# EAGLE schematic al (EAGLE 6.5.0)
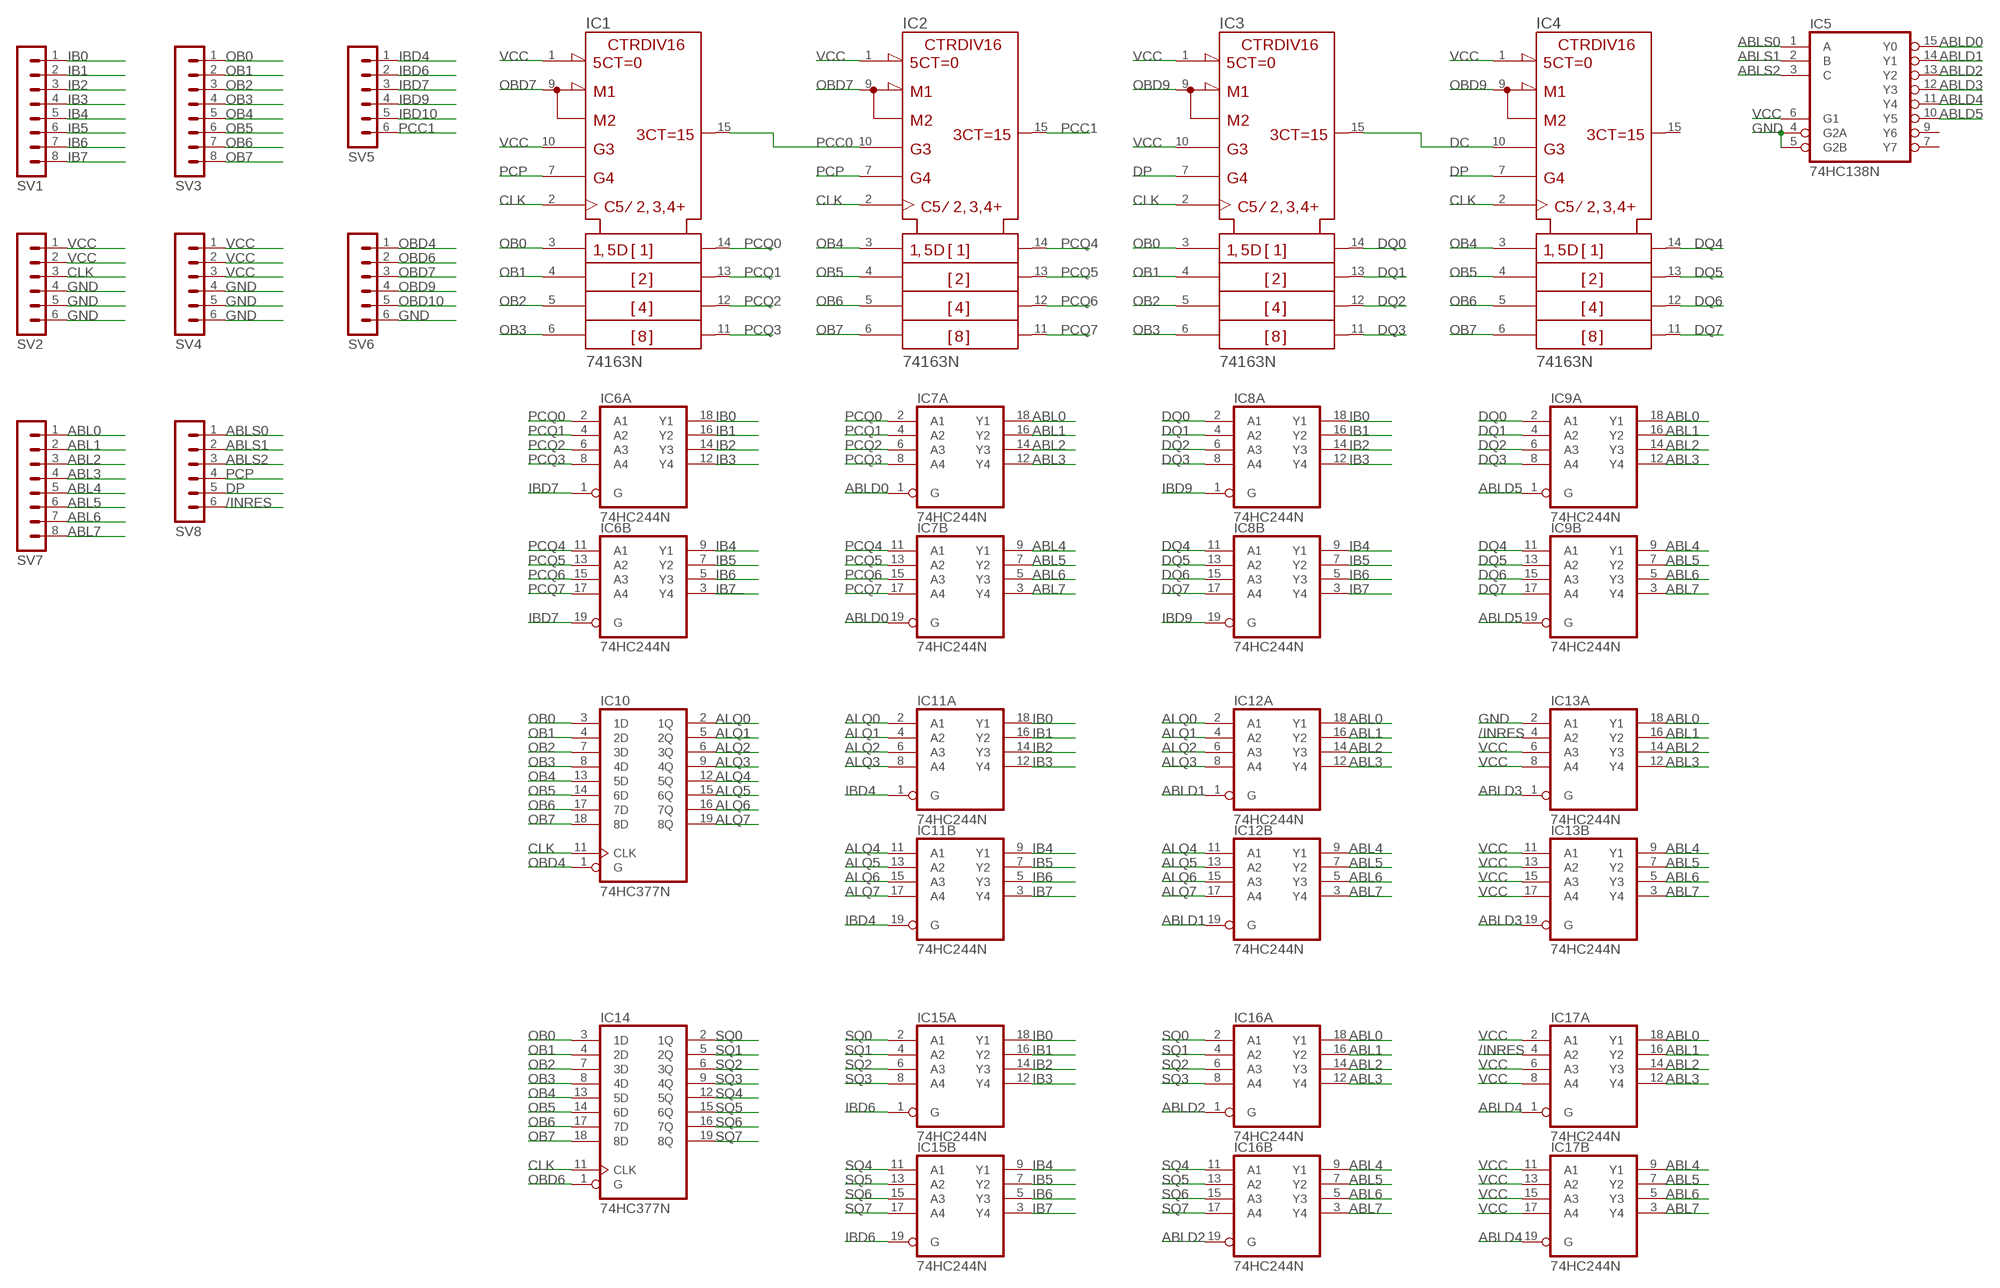
[diagram p0: schematic, sheet 1]

## Parts
IC1  74163N  [DIL16]
IC2  74163N  [DIL16]
IC3  74163N  [DIL16]
IC4  74163N  [DIL16]
IC5  74HC138N  [DIL16]
IC6  74HC244N  [DIL20]
IC7  74HC244N  [DIL20]
IC8  74HC244N  [DIL20]
IC9  74HC244N  [DIL20]
IC10  74HC377N  [DIL20]
IC11  74HC244N  [DIL20]
IC12  74HC244N  [DIL20]
IC13  74HC244N  [DIL20]
IC14  74HC377N  [DIL20]
IC15  74HC244N  [DIL20]
IC16  74HC244N  [DIL20]
IC17  74HC244N  [DIL20]
SV1  MA08-1  [MA08-1]
SV2  MA06-1  [MA06-1]
SV3  MA08-1  [MA08-1]
SV4  MA06-1  [MA06-1]
SV5  MA06-1  [MA06-1]
SV6  MA06-1  [MA06-1]
SV7  MA08-1  [MA08-1]
SV8  MA06-1  [MA06-1]

## Nets
/INRES: IC13.4(A:A2) IC17.4(A:A2) SV8.6
ABL0: IC7.18(A:Y1) IC9.18(A:Y1) IC12.18(A:Y1) IC13.18(A:Y1) IC16.18(A:Y1) IC17.18(A:Y1) SV7.1
ABL1: IC7.16(A:Y2) IC9.16(A:Y2) IC12.16(A:Y2) IC13.16(A:Y2) IC16.16(A:Y2) IC17.16(A:Y2) SV7.2
ABL2: IC7.14(A:Y3) IC9.14(A:Y3) IC12.14(A:Y3) IC13.14(A:Y3) IC16.14(A:Y3) IC17.14(A:Y3) SV7.3
ABL3: IC7.12(A:Y4) IC9.12(A:Y4) IC12.12(A:Y4) IC13.12(A:Y4) IC16.12(A:Y4) IC17.12(A:Y4) SV7.4
ABL4: IC7.9(B:Y1) IC9.9(B:Y1) IC12.9(B:Y1) IC13.9(B:Y1) IC16.9(B:Y1) IC17.9(B:Y1) SV7.5
ABL5: IC7.7(B:Y2) IC9.7(B:Y2) IC12.7(B:Y2) IC13.7(B:Y2) IC16.7(B:Y2) IC17.7(B:Y2) SV7.6
ABL6: IC7.5(B:Y3) IC9.5(B:Y3) IC12.5(B:Y3) IC13.5(B:Y3) IC16.5(B:Y3) IC17.5(B:Y3) SV7.7
ABL7: IC7.3(B:Y4) IC9.3(B:Y4) IC12.3(B:Y4) IC13.3(B:Y4) IC16.3(B:Y4) IC17.3(B:Y4) SV7.8
ABLD0: IC5.15(Y0) IC7.1(A:G) IC7.19(B:G)
ABLD1: IC5.14(Y1) IC12.1(A:G) IC12.19(B:G)
ABLD2: IC5.13(Y2) IC16.1(A:G) IC16.19(B:G)
ABLD3: IC5.12(Y3) IC13.1(A:G) IC13.19(B:G)
ABLD4: IC5.11(Y4) IC17.1(A:G) IC17.19(B:G)
ABLD5: IC5.10(Y5) IC9.1(A:G) IC9.19(B:G)
ABLS0: IC5.1(A) SV8.1
ABLS1: IC5.2(B) SV8.2
ABLS2: IC5.3(C) SV8.3
ALQ0: IC10.2(1Q) IC11.2(A:A1) IC12.2(A:A1)
ALQ1: IC10.5(2Q) IC11.4(A:A2) IC12.4(A:A2)
ALQ2: IC10.6(3Q) IC11.6(A:A3) IC12.6(A:A3)
ALQ3: IC10.9(4Q) IC11.8(A:A4) IC12.8(A:A4)
ALQ4: IC10.12(5Q) IC11.11(B:A1) IC12.11(B:A1)
ALQ5: IC10.15(6Q) IC11.13(B:A2) IC12.13(B:A2)
ALQ6: IC10.16(7Q) IC11.15(B:A3) IC12.15(B:A3)
ALQ7: IC10.19(8Q) IC11.17(B:A4) IC12.17(B:A4)
CLK: IC1.2(CLK) IC2.2(CLK) IC3.2(CLK) IC4.2(CLK) IC10.11(CLK) IC14.11(CLK) SV2.3
DC: IC3.15(RCO) IC4.10(ENT)
DP: IC3.7(ENP) IC4.7(ENP) SV8.5
DQ0: IC3.14(QA) IC8.2(A:A1) IC9.2(A:A1)
DQ1: IC3.13(QB) IC8.4(A:A2) IC9.4(A:A2)
DQ2: IC3.12(QC) IC8.6(A:A3) IC9.6(A:A3)
DQ3: IC3.11(QD) IC8.8(A:A4) IC9.8(A:A4)
DQ4: IC4.14(QA) IC8.11(B:A1) IC9.11(B:A1)
DQ5: IC4.13(QB) IC8.13(B:A2) IC9.13(B:A2)
DQ6: IC4.12(QC) IC8.15(B:A3) IC9.15(B:A3)
DQ7: IC4.11(QD) IC8.17(B:A4) IC9.17(B:A4)
GND: IC5.4(G2A) IC5.5(G2B) IC13.2(A:A1) SV2.4 SV2.5 SV2.6 SV4.4 SV4.5 SV4.6 SV6.6
IB0: IC6.18(A:Y1) IC8.18(A:Y1) IC11.18(A:Y1) IC15.18(A:Y1) SV1.1
IB1: IC6.16(A:Y2) IC8.16(A:Y2) IC11.16(A:Y2) IC15.16(A:Y2) SV1.2
IB2: IC6.14(A:Y3) IC8.14(A:Y3) IC11.14(A:Y3) IC15.14(A:Y3) SV1.3
IB3: IC6.12(A:Y4) IC8.12(A:Y4) IC11.12(A:Y4) IC15.12(A:Y4) SV1.4
IB4: IC6.9(B:Y1) IC8.9(B:Y1) IC11.9(B:Y1) IC15.9(B:Y1) SV1.5
IB5: IC6.7(B:Y2) IC8.7(B:Y2) IC11.7(B:Y2) IC15.7(B:Y2) SV1.6
IB6: IC6.5(B:Y3) IC8.5(B:Y3) IC11.5(B:Y3) IC15.5(B:Y3) SV1.7
IB7: IC6.3(B:Y4) IC8.3(B:Y4) IC11.3(B:Y4) IC15.3(B:Y4) SV1.8
IBD4: IC11.1(A:G) IC11.19(B:G) SV5.1
IBD6: IC15.1(A:G) IC15.19(B:G) SV5.2
IBD7: IC6.1(A:G) IC6.19(B:G) SV5.3
IBD9: IC8.1(A:G) IC8.19(B:G) SV5.4
IBD10: SV5.5
OB0: IC1.3(A) IC3.3(A) IC10.3(1D) IC14.3(1D) SV3.1
OB1: IC1.4(B) IC3.4(B) IC10.4(2D) IC14.4(2D) SV3.2
OB2: IC1.5(C) IC3.5(C) IC10.7(3D) IC14.7(3D) SV3.3
OB3: IC1.6(D) IC3.6(D) IC10.8(4D) IC14.8(4D) SV3.4
OB4: IC2.3(A) IC4.3(A) IC10.13(5D) IC14.13(5D) SV3.5
OB5: IC2.4(B) IC4.4(B) IC10.14(6D) IC14.14(6D) SV3.6
OB6: IC2.5(C) IC4.5(C) IC10.17(7D) IC14.17(7D) SV3.7
OB7: IC2.6(D) IC4.6(D) IC10.18(8D) IC14.18(8D) SV3.8
OBD4: IC10.1(G) SV6.1
OBD6: IC14.1(G) SV6.2
OBD7: IC1.9(!LOAD) IC2.9(!LOAD) SV6.3
OBD9: IC3.9(!LOAD) IC4.9(!LOAD) SV6.4
OBD10: SV6.5
PCC0: IC1.15(RCO) IC2.10(ENT)
PCC1: IC2.15(RCO) SV5.6
PCP: IC1.7(ENP) IC2.7(ENP) SV8.4
PCQ0: IC1.14(QA) IC6.2(A:A1) IC7.2(A:A1)
PCQ1: IC1.13(QB) IC6.4(A:A2) IC7.4(A:A2)
PCQ2: IC1.12(QC) IC6.6(A:A3) IC7.6(A:A3)
PCQ3: IC1.11(QD) IC6.8(A:A4) IC7.8(A:A4)
PCQ4: IC2.14(QA) IC6.11(B:A1) IC7.11(B:A1)
PCQ5: IC2.13(QB) IC6.13(B:A2) IC7.13(B:A2)
PCQ6: IC2.12(QC) IC6.15(B:A3) IC7.15(B:A3)
PCQ7: IC2.11(QD) IC6.17(B:A4) IC7.17(B:A4)
SQ0: IC14.2(1Q) IC15.2(A:A1) IC16.2(A:A1)
SQ1: IC14.5(2Q) IC15.4(A:A2) IC16.4(A:A2)
SQ2: IC14.6(3Q) IC15.6(A:A3) IC16.6(A:A3)
SQ3: IC14.9(4Q) IC15.8(A:A4) IC16.8(A:A4)
SQ4: IC14.12(5Q) IC15.11(B:A1) IC16.11(B:A1)
SQ5: IC14.15(6Q) IC15.13(B:A2) IC16.13(B:A2)
SQ6: IC14.16(7Q) IC15.15(B:A3) IC16.15(B:A3)
SQ7: IC14.19(8Q) IC15.17(B:A4) IC16.17(B:A4)
VCC: IC1.1(!CLR) IC1.10(ENT) IC2.1(!CLR) IC3.1(!CLR) IC3.10(ENT) IC4.1(!CLR) IC5.6(G1) IC13.6(A:A3) IC13.8(A:A4) IC13.11(B:A1) IC13.13(B:A2) IC13.15(B:A3) IC13.17(B:A4) IC17.2(A:A1) IC17.6(A:A3) IC17.8(A:A4) IC17.11(B:A1) IC17.13(B:A2) IC17.15(B:A3) IC17.17(B:A4) SV2.1 SV2.2 SV4.1 SV4.2 SV4.3
Unconnected: IC4.15(RCO) IC5.7(Y7) IC5.9(Y6)

## Power pins joined to a net without a drawn wire
+UB: IC1.16(+UB) IC2.16(+UB) IC3.16(+UB) IC4.16(+UB)
-UB: IC1.8(-UB) IC2.8(-UB) IC3.8(-UB) IC4.8(-UB)
GND: IC5.8(GND) IC6.10(P:GND) IC7.10(P:GND) IC8.10(P:GND) IC9.10(P:GND) IC10.10(GND) IC11.10(P:GND) IC12.10(P:GND) IC13.10(P:GND) IC14.10(GND) IC15.10(P:GND) IC16.10(P:GND) IC17.10(P:GND)
VCC: IC5.16(VCC) IC6.20(P:VCC) IC7.20(P:VCC) IC8.20(P:VCC) IC9.20(P:VCC) IC10.20(VCC) IC11.20(P:VCC) IC12.20(P:VCC) IC13.20(P:VCC) IC14.20(VCC) IC15.20(P:VCC) IC16.20(P:VCC) IC17.20(P:VCC)

## Library data of the parts
IC1-IC4 = 74ttl-din:74*163: Synchrounus 4-bit COUNTER
IC5 = 74xx-eu:74*138: 3-line to 8-line DECODER/DEMULTIPLEXER
IC6-IC9 IC11-IC13 IC15-IC17 = 74xx-eu:74*244: Octal BUFFER and LINE DRIVER, 3-state
IC10 IC14 = 74xx-eu:74*377: Octal D type FLIP FLOP, enable
SV1 SV3 SV7 = con-lstb:MA08-1: PIN HEADER; OC_FARNELL: unknown; OC_NEWARK: unknown
SV2 SV4-SV6 SV8 = con-lstb:MA06-1: PIN HEADER; OC_FARNELL: unknown; OC_NEWARK: unknown